# Altium schematic sheet 09 USB HUB.SchDoc
size A3
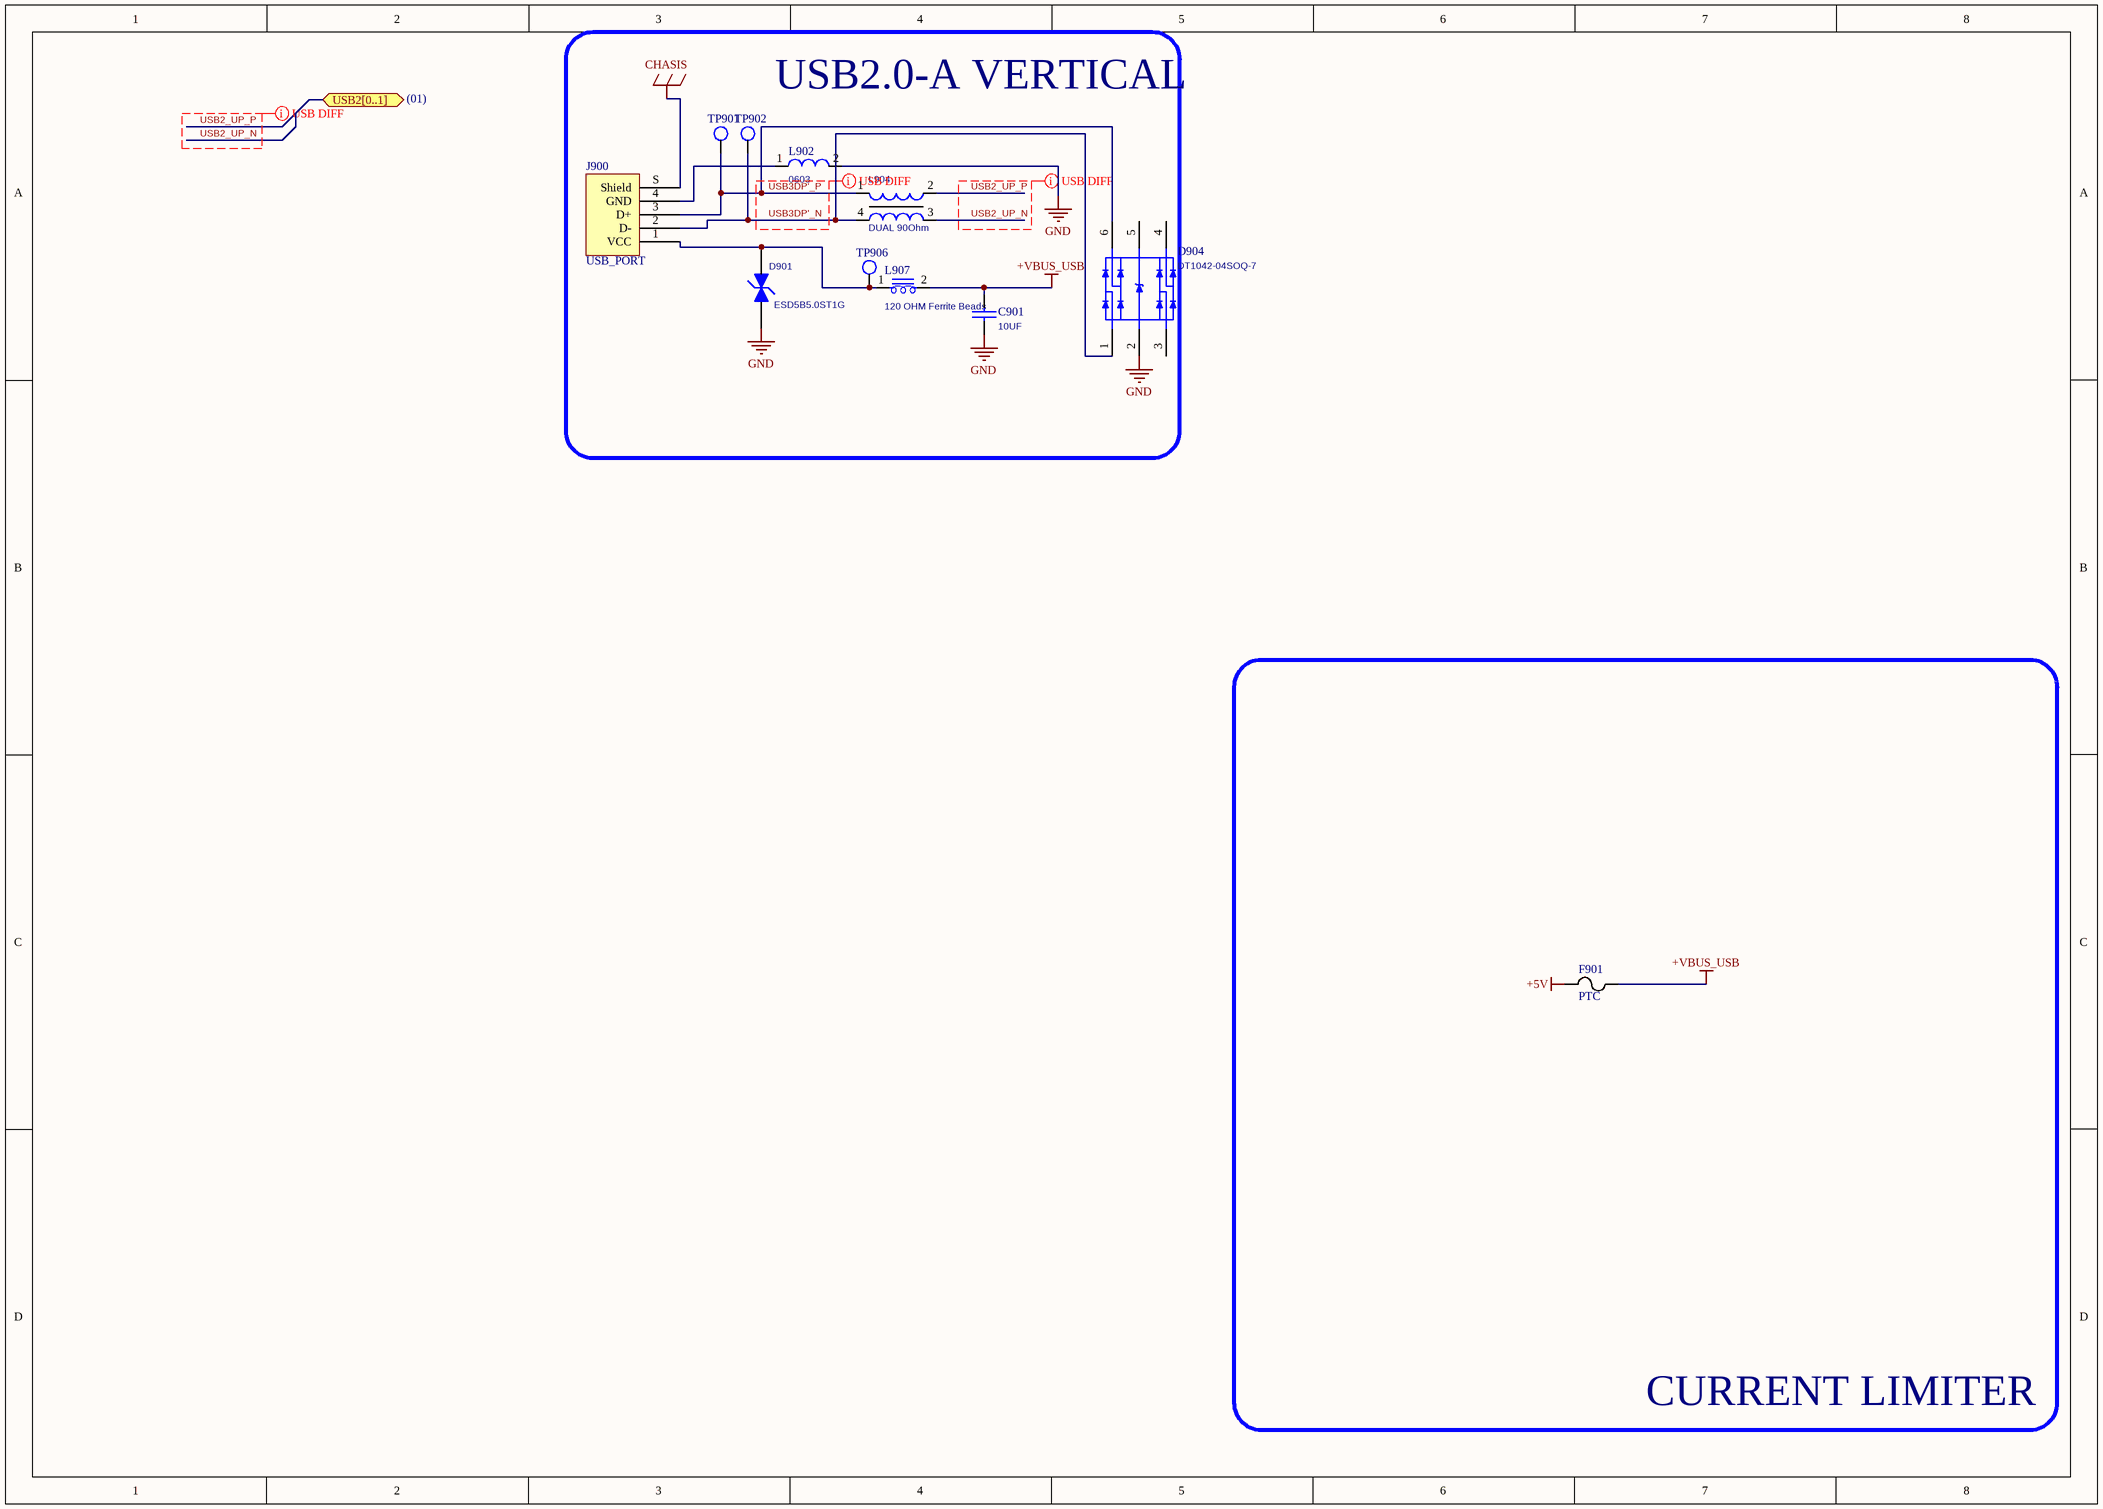
[diagram p0: 09 USB HUB.SchDoc]

## Parts
C901  10UF  [0805]
D901  ESD5B5.0ST1G  [SOD523 - SZESD]
D904  DT1042-04SOQ-7  [DIODE-DT1042-04SOQ-7]
F901  PTC  [1812]
J900  USB_PORT  [ON SHORE TECHNOLOGY USB-A1HSW6]
L902  0603  [0603_RES]
L904  DUAL 90Ohm  [DLW21H]
L907  120 OHM Ferrite Beads  [0603_RES]
TP901  TEST POINT 15  [testpoint_15]  (value not drawn)  (no BOM)
TP902  TEST POINT 15  [testpoint_15]  (value not drawn)  (no BOM)
TP906  TEST POINT 15  [testpoint_15]  (value not drawn)  (no BOM)

## Blocks framed on the sheet
USB2.0-A VERTICAL: C901 D901 D904 J900 L902 L904 L907 TP901 TP902 TP906
CURRENT LIMITER: F901

## Ports
USB2[0..1] (bidir)

## Nets
+5V: F901.1
+VBUS_USB: C901.1 F901.2 L907.2
CHASIS: J900.S(Shield)
GND: C901.2 D901.1(A) D904.2(VSS) L902.2
USB2_UP_N: L904.3
USB2_UP_P: L904.2
USB3DP'_N: D904.1(IO1) J900.2(D-) L904.4 TP902.1
USB3DP'_P: D904.6(IO4) J900.3(D+) L904.1 TP901.1
NetD901_2: D901.2(K) J900.1(VCC) L907.1 TP906.1
NetJ900_4: J900.4(GND) L902.1

Not connected (* = marked no-connect by the designer): D904 3(IO2) 4(IO3) 5(VCC)

## Layout directives
differential pair; differential pair class USB 90 OHM DIFF; net class USB: USB2_UP_N, USB2_UP_P, USB3DP'_N, USB3DP'_P
differential pair; differential pair class USB 90 OHM DIFF; net class USB; net class USB: USB2_UP_N, USB2_UP_P

## Notes on the sheet
- (01)
- Sheet Title:
- Inventron
- Size:
- Drawn By:
- Revision:
- Project:
- Checked By:
- A4
- Sheet
- of
- Budotek Teknopark
- Dudullu OSB
- Des 2. Cadde No:8/30
- Umraniye / ISTANBUL
- Electronics and Software
- Date:
- Time:
- ©2020 Inventron Electronics and Software. All rights reserved.

## Library data of the parts
C901 = CAP-CL21A106KOQNNNG: CAP CER 10UF 16V X5R 0805; Manufacturer-1: SAMSUNG; Class: Capacitor; Manufacturer Part Number-1: CL21A106KOQNNNG; Footprint: *; Manufacturer-2: *; Manufacturer Part Number-2: *; Inventron Stock No: *; Created By: EE; Created Date: *; Checked By: *; ASSY_OPT: *; Dimensions: *; Unit Price: 0.01876; Revision Date/Note: *; Price Break: 3000; Opt. Temp.: *; Features: *
D901 = DIODE-ESD5B5.0ST1G: VS DIODE 5V SOD523; Manufacturer-1: ON Semiconductor; Opt. Temp.: -55/+150; Manufacturer Part Number-1: ESD5B5.0ST1G; Footprint: SOD-523; Manufacturer-2: *; Manufacturer Part Number-2: *; Inventron Stock No: *; Created By: E.E; Created Date: 3.11.2020; Checked By: *; ASSY_OPT: *; Dimensions: *; Unit Price: 0,0129; Revision Date/Note: *; Price Break: 3000; Class: Diode; Features: AUTOMOTIVE
D904 = DIODE-DT1042-04SOQ-7: HDMI TVS DIODE; Manufacturer-1: Diodes Incorporated; Opt. Temp.: -55°C ~ 85°C (TA); Manufacturer Part Number-1: DT1042-04SOQ-7; Footprint: SOT26; Manufacturer-2: *; Manufacturer Part Number-2: *; Inventron Stock No: *; Created By: E.E; Created Date: 23.10.2020; Checked By: *; ASSY_OPT: *; Dimensions: *; Unit Price: 0.07575; Revision Date/Note: *; Price Break: 3000; Class: Diode
F901 = FUSE-KMC5S110RY33: THERMISTOR PTC RESETTABLE FUSE 1206 1100mA 33V 1812; Manufacturer-1: THINKING; Manufacturer Part Number-1: KMC5S110RY33; Manufacturer-2: *; Manufacturer Part Number-2: *; Inventron Stock No: *; Created By: EE; Created Date: *; Checked By: *; ASSY_OPT: *; Dimensions: *; Unit Price: 0.083; Revision Date/Note: *; Price Break: 4000; Opt. Temp.: *; Class: FUSE
J900 = USB-A1HSW6: CONN RCPT TYPEA 4POS R/A; Manufacturer: On Shore Technology Inc.; Connector Type: USB - A; Current Rating (Amps): 1A; Gender: Receptacle; Number of Contacts: 4; Number of Ports: 1; Shielding: Unshielded; Voltage - Rated: 30VAC; Part Number: USB-A1HSW6; ComponentLink1Description: Datasheet; ComponentLink1URL: http://www.on-shore.com/wp-content/uploads/USB-A1HSXX.pdf; ComponentLink2Description: DigiKey Link; ComponentLink2URL: http://digikey.com/product-detail/en/on-shore-technology-inc/USB-A1HSW6/ED2989-ND/2677750; Features: Board Lock; LastUpdated: 4/30/2020 11:56:44 AM; Lifecycle Status: Active; Minimum Order: 1; Mounting Feature: Horizontal; Mounting Type: Through Hole, Right Angle; Operating Temperature: 0°C ~ 85°C; Packaging: Tray; Part Status: Active; Price: 0.48; Series: -; Supplier 1: DigiKey; Supplier Part Number 1: ED2989-ND; Termination: Solder
L902 = IND-FERRITE (RES 0 OHM) 0603: 0OHM 0603; Manufacturer Part Number-1: RC0603JR-070RL; Manufacturer-1: YAGEO; Class: Inductor; Footprint: 0603; Manufacturer-2: *; Inventron Stock No: *; Created By: EE; Checked By: *; ASSY_OPT: *; Dimensions: *; Revision Date/Note: *
L904 = IND-DLW21HN900SQ2L: Common Mode Chokes Dual 90Ohm 100MHz 0.33A 0.35Ohm DCR SMD T/R; Manufacturer-1: Murata Manufacturing; Class: Inductor; Manufacturer Part Number-1: DLW21HN900SQ2L; Footprint: *; Manufacturer-2: *; Manufacturer Part Number-2: *; Inventron Stock No: *; Created By: E.E; Created Date: 2.11.2020; Checked By: *; ASSY_OPT: *; Dimensions: *; Unit Price: 0.185; Revision Date/Note: *; Price Break: 3000; Opt. Temp.: *; Features: *
L907 = IND-BLM18PG121SH1D: Ferrite Beads Multi-Layer 120Ohm 25% 100MHz 2A 0.05Ohm DCR 0603 Automotive T/R; Manufacturer-1: Murata Manufacturing; Class: Inductor; Manufacturer Part Number-1: BLM18PG121SH1D; Footprint: 0603; Manufacturer-2: *; Manufacturer Part Number-2: *; Inventron Stock No: *; Created By: E.E; Created Date: 2.11.2020; Checked By: *; ASSY_OPT: *; Dimensions: *; Unit Price: 0.02550; Revision Date/Note: *; Price Break: 4000; Opt. Temp.: *; Features: *